# EAGLE schematic Analog CAN Module (EAGLE 8.3.2)
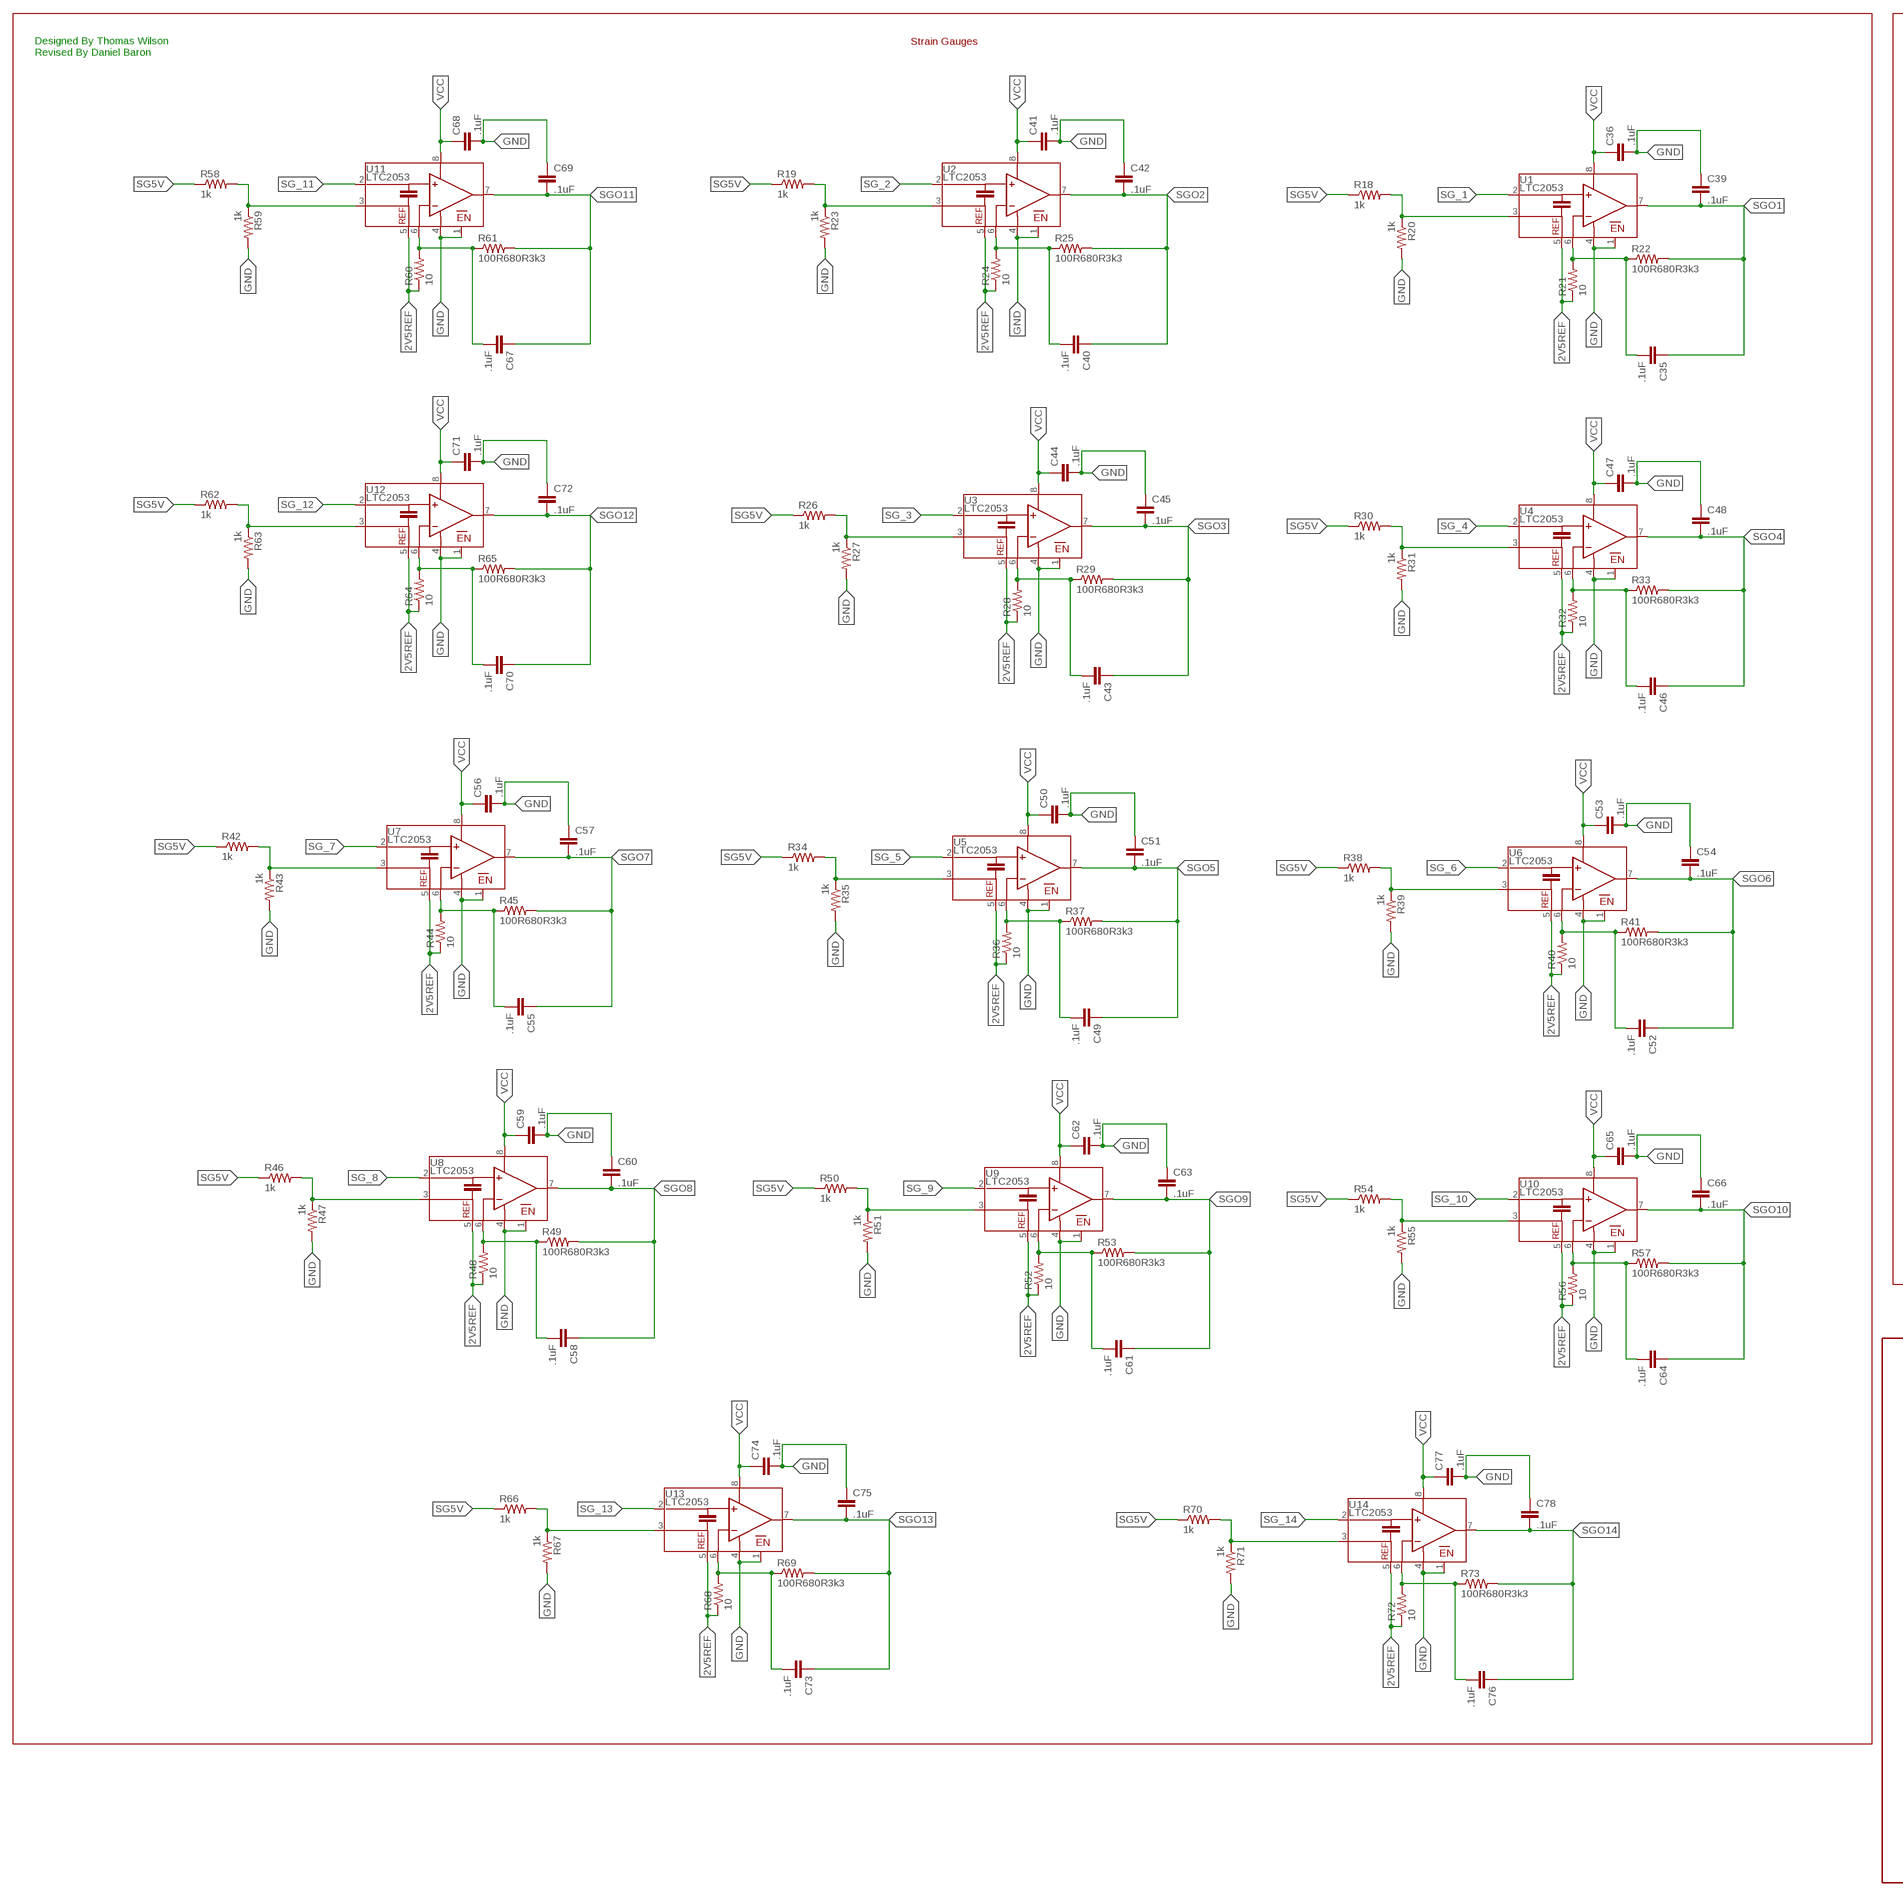
[diagram p0: schematic, sheet 1, part 1 of 3]
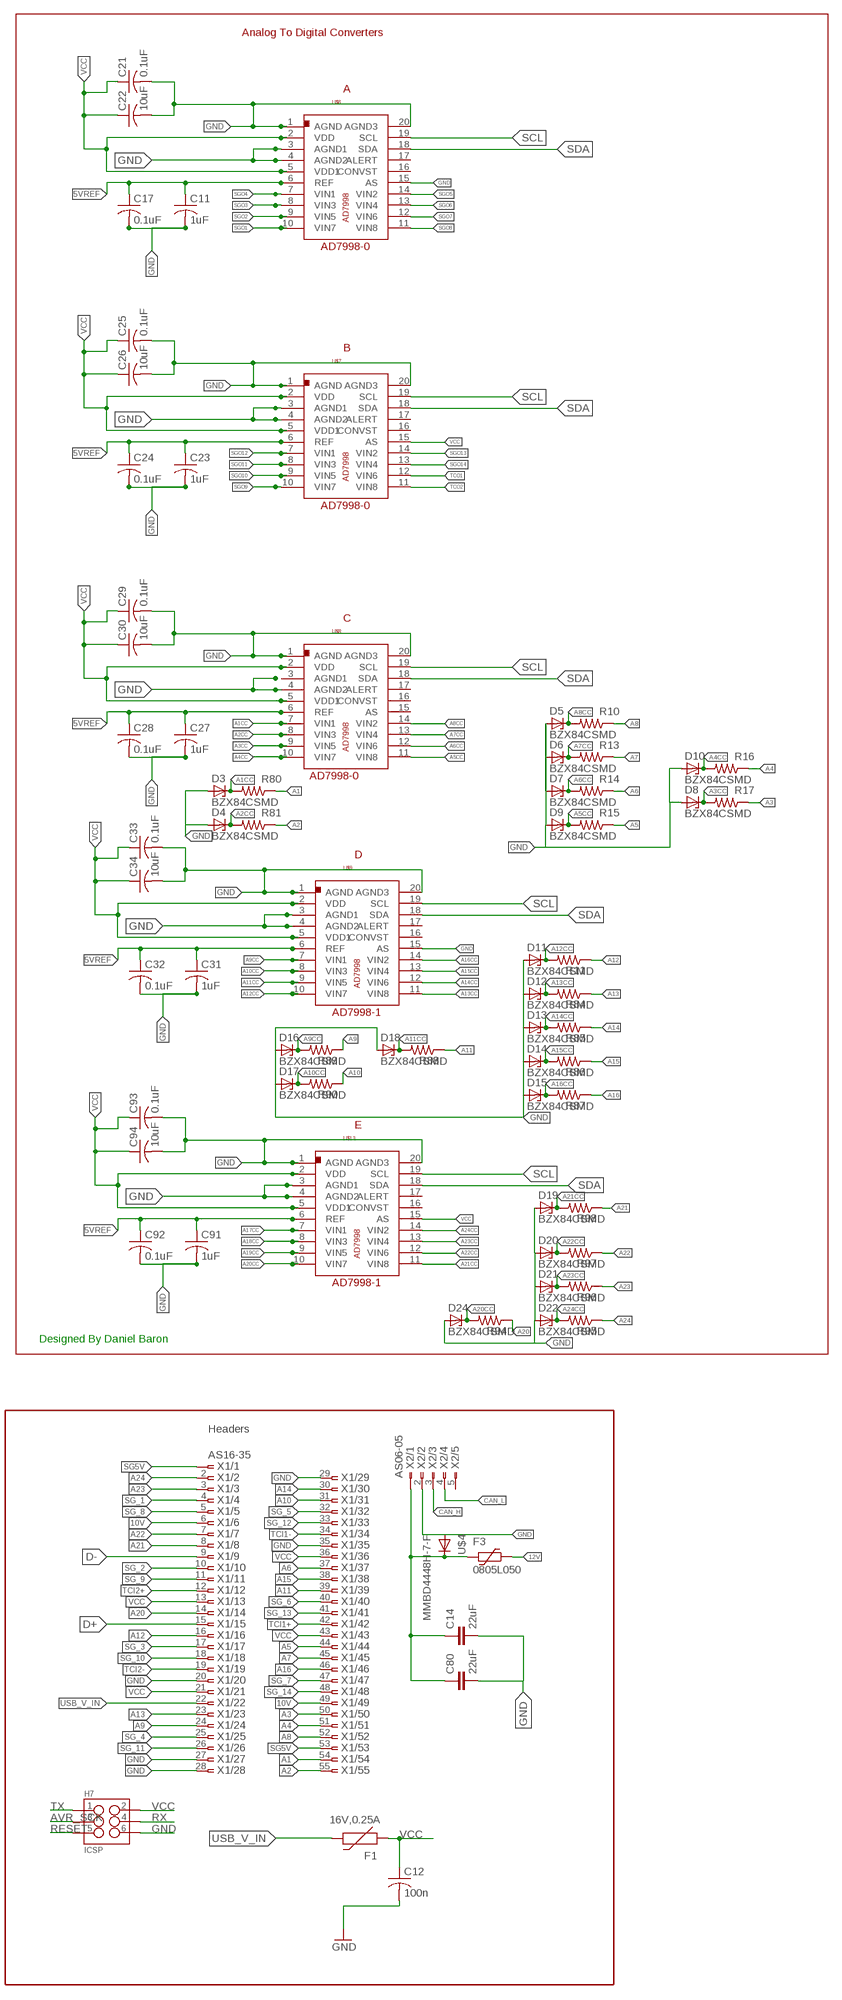
[diagram p1: schematic, sheet 1, part 2 of 3]
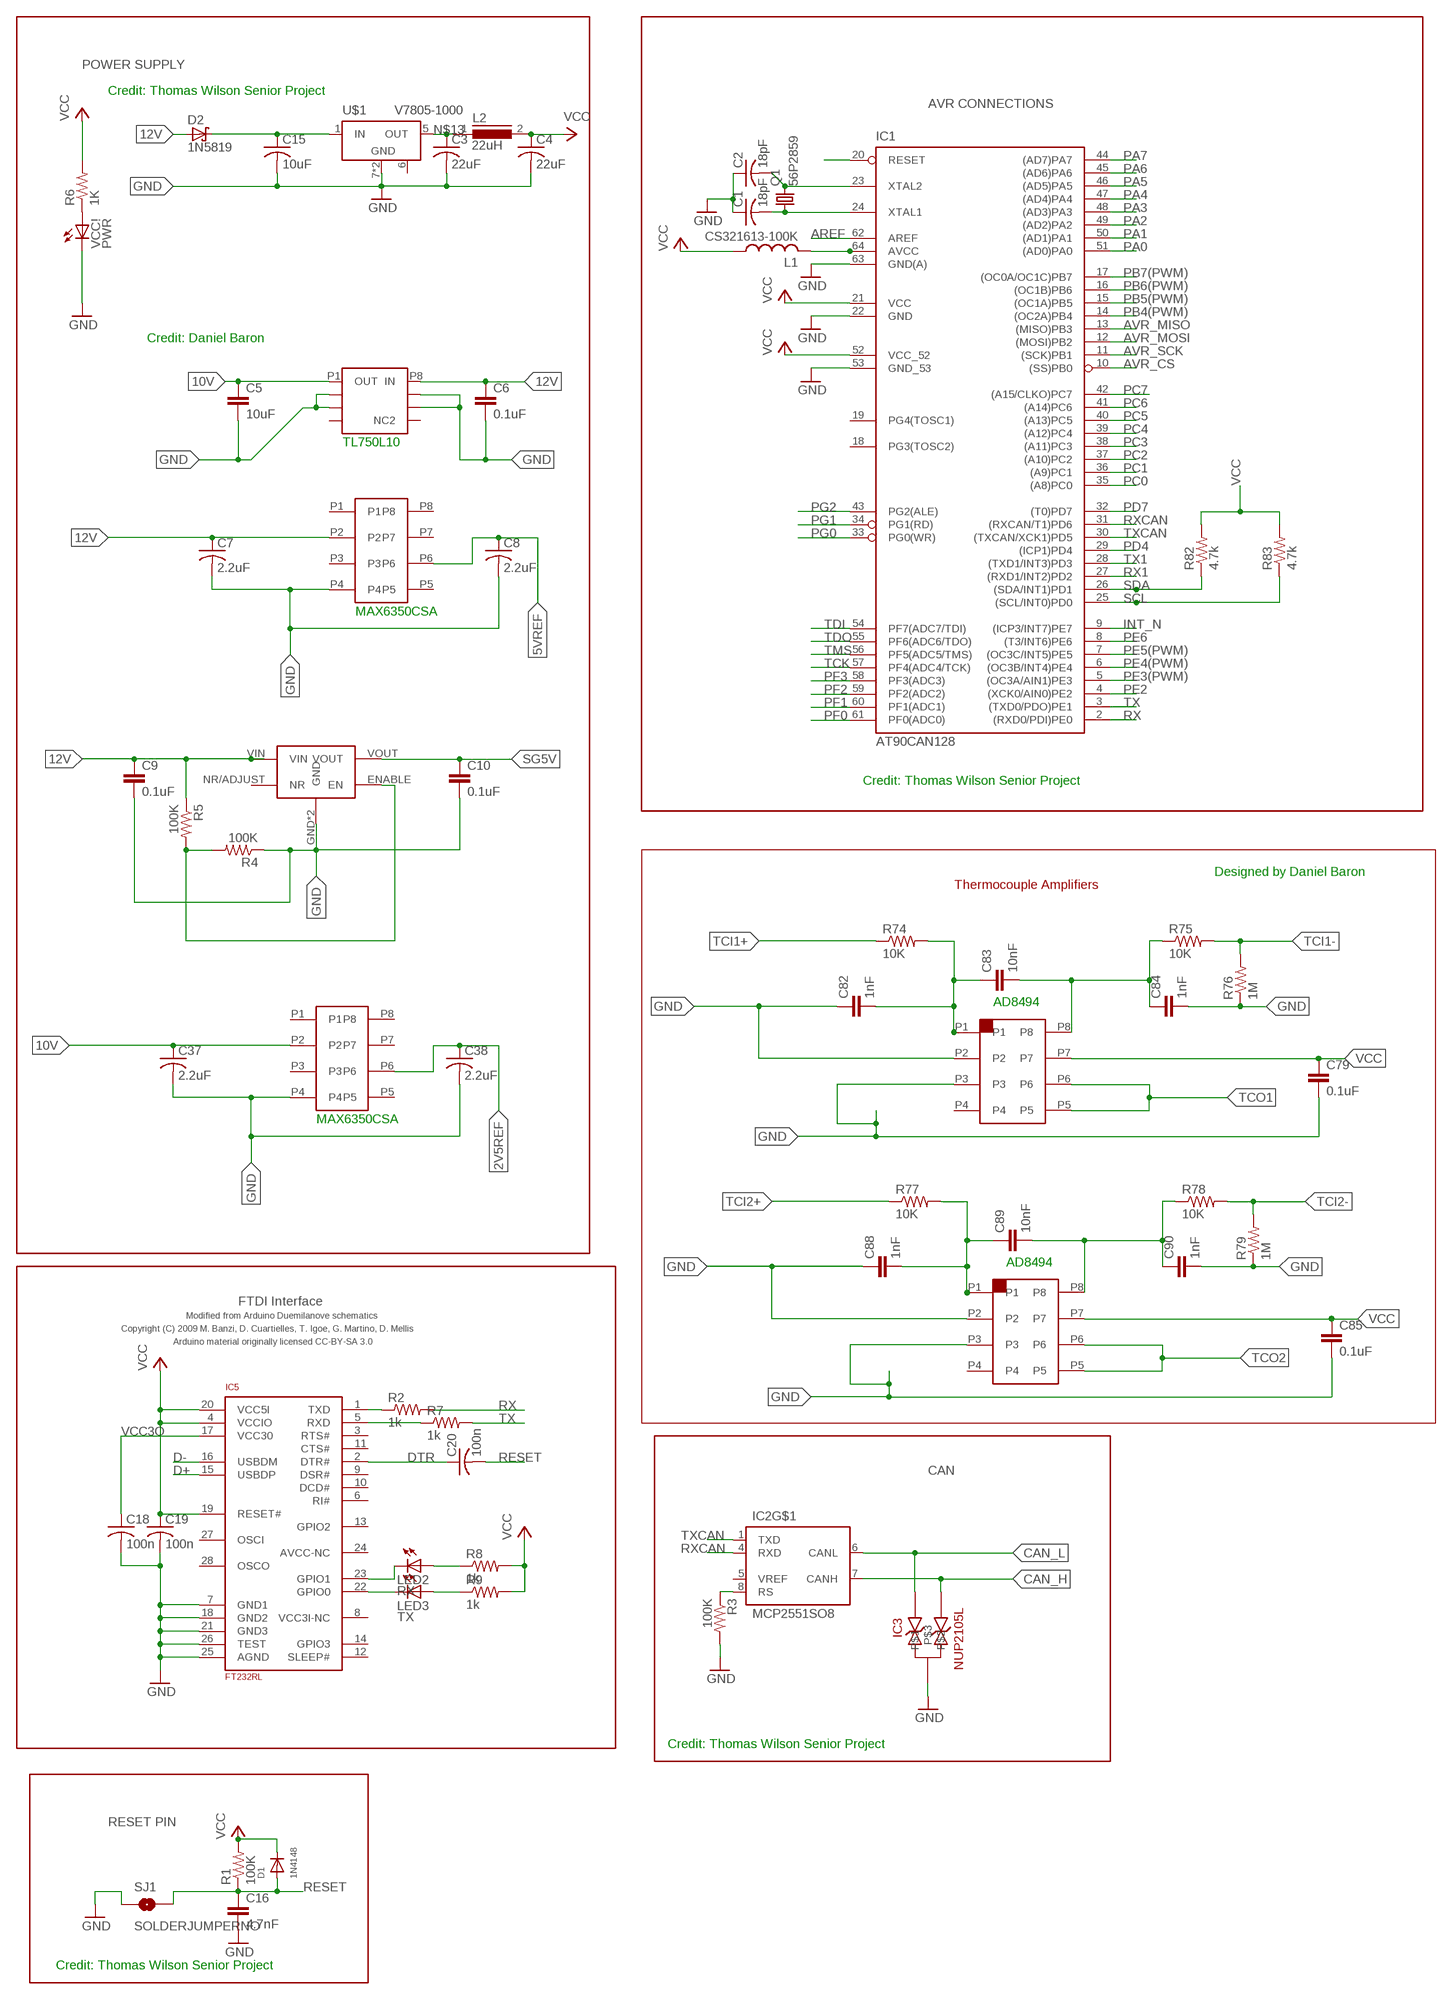
[diagram p2: schematic, sheet 1, part 3 of 3]

## Parts
C1  18pF  C-USC0805  [C0805@1]
C2  18pF  C-USC0805  [C0805@1]
C3  22uF  C-USC0805  [C0805]
C4  22uF  C-USC0805  [C0805]
C5  10uF  C-EUC0805  [C0805]
C6  0.1uF  C-EUC0603  [C0603]
C7  2.2uF  C-USC0603  [C0603@1]
C8  2.2uF  C-USC0603  [C0603@1]
C9  0.1uF  C-EUC0603  [C0603]
C10  0.1uF  C-EUC0603  [C0603]
C11  1uF  C-USC0603  [C0603@1]
C12  100n  C-USC0805  [C0805@1]
C14  22uF  C-EUC0805  [C0805]
C15  10uF  C-USC0805  [C0805]
C16  4.7nF  CAP0603-CAP  [0603-CAP]
C17  0.1uF  C-USC0603  [C0603@1]
C18  100n  C-USC0805  [C0805@1]
C19  100n  C-USC0805  [C0805@1]
C20  100n  C-USC0805  [C0805@1]
C21  0.1uF  C-USC0603  [C0603@1]
C22  10uF  C-USC0805  [C0805@1]
C23  1uF  C-USC0603  [C0603@1]
C24  0.1uF  C-USC0603  [C0603@1]
C25  0.1uF  C-USC0603  [C0603@1]
C26  10uF  C-USC0805  [C0805@1]
C27  1uF  C-USC0603  [C0603@1]
C28  0.1uF  C-USC0603  [C0603@1]
C29  0.1uF  C-USC0603  [C0603@1]
C30  10uF  C-USC0805  [C0805@1]
C31  1uF  C-USC0603  [C0603@1]
C32  0.1uF  C-USC0603  [C0603@1]
C33  0.1uF  C-USC0603  [C0603@1]
C34  10uF  C-USC0805  [C0805@1]
C35  .1uF  CAP0603-CAP  [0603-CAP]
C36  .1uF  CAP0603-CAP  [0603-CAP]
C37  2.2uF  C-USC0603  [C0603@1]
C38  2.2uF  C-USC0603  [C0603@1]
C39  .1uF  CAP0603-CAP  [0603-CAP]
C40  .1uF  CAP0603-CAP  [0603-CAP]
C41  .1uF  CAP0603-CAP  [0603-CAP]
C42  .1uF  CAP0603-CAP  [0603-CAP]
C43  .1uF  CAP0603-CAP  [0603-CAP]
C44  .1uF  CAP0603-CAP  [0603-CAP]
C45  .1uF  CAP0603-CAP  [0603-CAP]
C46  .1uF  CAP0603-CAP  [0603-CAP]
C47  .1uF  CAP0603-CAP  [0603-CAP]
C48  .1uF  CAP0603-CAP  [0603-CAP]
C49  .1uF  CAP0603-CAP  [0603-CAP]
C50  .1uF  CAP0603-CAP  [0603-CAP]
C51  .1uF  CAP0603-CAP  [0603-CAP]
C52  .1uF  CAP0603-CAP  [0603-CAP]
C53  .1uF  CAP0603-CAP  [0603-CAP]
C54  .1uF  CAP0603-CAP  [0603-CAP]
C55  .1uF  CAP0603-CAP  [0603-CAP]
C56  .1uF  CAP0603-CAP  [0603-CAP]
C57  .1uF  CAP0603-CAP  [0603-CAP]
C58  .1uF  CAP0603-CAP  [0603-CAP]
C59  .1uF  CAP0603-CAP  [0603-CAP]
C60  .1uF  CAP0603-CAP  [0603-CAP]
C61  .1uF  CAP0603-CAP  [0603-CAP]
C62  .1uF  CAP0603-CAP  [0603-CAP]
C63  .1uF  CAP0603-CAP  [0603-CAP]
C64  .1uF  CAP0603-CAP  [0603-CAP]
C65  .1uF  CAP0603-CAP  [0603-CAP]
C66  .1uF  CAP0603-CAP  [0603-CAP]
C67  .1uF  CAP0603-CAP  [0603-CAP]
C68  .1uF  CAP0603-CAP  [0603-CAP]
C69  .1uF  CAP0603-CAP  [0603-CAP]
C70  .1uF  CAP0603-CAP  [0603-CAP]
C71  .1uF  CAP0603-CAP  [0603-CAP]
C72  .1uF  CAP0603-CAP  [0603-CAP]
C73  .1uF  CAP0603-CAP  [0603-CAP]
C74  .1uF  CAP0603-CAP  [0603-CAP]
C75  .1uF  CAP0603-CAP  [0603-CAP]
C76  .1uF  CAP0603-CAP  [0603-CAP]
C77  .1uF  CAP0603-CAP  [0603-CAP]
C78  .1uF  CAP0603-CAP  [0603-CAP]
C79  0.1uF  C-EUC0603  [C0603]
C80  22uF  C-EUC0805  [C0805]
C82  1nF  C-EUC0603  [C0603]
C83  10nF  C-EUC0603  [C0603]
C84  1nF  C-EUC0603  [C0603]
C85  0.1uF  C-EUC0603  [C0603]
C88  1nF  C-EUC0603  [C0603]
C89  10nF  C-EUC0603  [C0603]
C90  1nF  C-EUC0603  [C0603]
C91  1uF  C-USC0603  [C0603@1]
C92  0.1uF  C-USC0603  [C0603@1]
C93  0.1uF  C-USC0603  [C0603@1]
C94  10uF  C-USC0805  [C0805@1]
D1  1N4148  DIODESOD-123  [SOD-123]
D2  1N5819  1N5819-B  [DO41-7.6]
D3  BZX84CSMD  [TO236]
D4  BZX84CSMD  [TO236]
D5  BZX84CSMD  [TO236]
D6  BZX84CSMD  [TO236]
D7  BZX84CSMD  [TO236]
D8  BZX84CSMD  [TO236]
D9  BZX84CSMD  [TO236]
D10  BZX84CSMD  [TO236]
D11  BZX84CSMD  [TO236]
D12  BZX84CSMD  [TO236]
D13  BZX84CSMD  [TO236]
D14  BZX84CSMD  [TO236]
D15  BZX84CSMD  [TO236]
D16  BZX84CSMD  [TO236]
D17  BZX84CSMD  [TO236]
D18  BZX84CSMD  [TO236]
D19  BZX84CSMD  [TO236]
D20  BZX84CSMD  [TO236]
D21  BZX84CSMD  [TO236]
D22  BZX84CSMD  [TO236]
D24  BZX84CSMD  [TO236]
F1  16V,0.25A  PTCSMD  [PTC-1206]
F3  0805L050  [0805L]
H7  ICSP  M03X2SMD_FCI  [2X3_SMD_FCI_54202-G30]
IC1  AT90CAN128  [TQFP64]
IC2  MCP2551SO8  [SO08]
IC3  NUP2105L  [SOT-23]
IC5  FT232RL  [SSOP28]
L1  CS321613-100K  L-USL3216C  [L3216C]
L2  22uH  DR73  [DR73]
LED2  RX  LEDCHIPLED_0805  [CHIPLED_0805]
LED3  TX  LEDCHIPLED_0805  [CHIPLED_0805]
Q1  56P2859  CRYSTALSMD  [HC49UP]
R1  100K  R-US_R0805  [R0805]
R2  1k  R-US_R0805  [R0805]
R3  100K  R-US_R0805  [R0805]
R4  100K  R-US_M0805  [M0805]
R5  100K  R-US_M0805  [M0805]
R6  1K  R-US_R0805  [R0805]
R7  1k  R-US_R0805  [R0805]
R8  1k  R-US_R0805  [R0805]
R9  1k  R-US_R0805  [R0805]
R10  180  R-US_R0603  [R0603]
R11  R-US_R0603  [R0603]
R13  180  R-US_R0603  [R0603]
R14  180  R-US_R0603  [R0603]
R15  180  R-US_R0603  [R0603]
R16  180  R-US_R0603  [R0603]
R17  180  R-US_R0603  [R0603]
R18  1k  RESISTOR0603  [0603-RES]
R19  1k  RESISTOR0603  [0603-RES]
R20  1k  RESISTOR0603  [0603-RES]
R21  10  RESISTOR0603  [0603-RES]
R22  100R680R3k3  RESISTOR0603  [0603-RES]
R23  1k  RESISTOR0603  [0603-RES]
R24  10  RESISTOR0603  [0603-RES]
R25  100R680R3k3  RESISTOR0603  [0603-RES]
R26  1k  RESISTOR0603  [0603-RES]
R27  1k  RESISTOR0603  [0603-RES]
R28  10  RESISTOR0603  [0603-RES]
R29  100R680R3k3  RESISTOR0603  [0603-RES]
R30  1k  RESISTOR0603  [0603-RES]
R31  1k  RESISTOR0603  [0603-RES]
R32  10  RESISTOR0603  [0603-RES]
R33  100R680R3k3  RESISTOR0603  [0603-RES]
R34  1k  RESISTOR0603  [0603-RES]
R35  1k  RESISTOR0603  [0603-RES]
R36  10  RESISTOR0603  [0603-RES]
R37  100R680R3k3  RESISTOR0603  [0603-RES]
R38  1k  RESISTOR0603  [0603-RES]
R39  1k  RESISTOR0603  [0603-RES]
R40  10  RESISTOR0603  [0603-RES]
R41  100R680R3k3  RESISTOR0603  [0603-RES]
R42  1k  RESISTOR0603  [0603-RES]
R43  1k  RESISTOR0603  [0603-RES]
R44  10  RESISTOR0603  [0603-RES]
R45  100R680R3k3  RESISTOR0603  [0603-RES]
R46  1k  RESISTOR0603  [0603-RES]
R47  1k  RESISTOR0603  [0603-RES]
R48  10  RESISTOR0603  [0603-RES]
R49  100R680R3k3  RESISTOR0603  [0603-RES]
R50  1k  RESISTOR0603  [0603-RES]
R51  1k  RESISTOR0603  [0603-RES]
R52  10  RESISTOR0603  [0603-RES]
R53  100R680R3k3  RESISTOR0603  [0603-RES]
R54  1k  RESISTOR0603  [0603-RES]
R55  1k  RESISTOR0603  [0603-RES]
R56  10  RESISTOR0603  [0603-RES]
R57  100R680R3k3  RESISTOR0603  [0603-RES]
R58  1k  RESISTOR0603  [0603-RES]
R59  1k  RESISTOR0603  [0603-RES]
R60  10  RESISTOR0603  [0603-RES]
R61  100R680R3k3  RESISTOR0603  [0603-RES]
R62  1k  RESISTOR0603  [0603-RES]
R63  1k  RESISTOR0603  [0603-RES]
R64  10  RESISTOR0603  [0603-RES]
R65  100R680R3k3  RESISTOR0603  [0603-RES]
R66  1k  RESISTOR0603  [0603-RES]
R67  1k  RESISTOR0603  [0603-RES]
R68  10  RESISTOR0603  [0603-RES]
R69  100R680R3k3  RESISTOR0603  [0603-RES]
R70  1k  RESISTOR0603  [0603-RES]
R71  1k  RESISTOR0603  [0603-RES]
R72  10  RESISTOR0603  [0603-RES]
R73  100R680R3k3  RESISTOR0603  [0603-RES]
R74  10K  RESISTOR0603  [0603-RES]
R75  10K  RESISTOR0603  [0603-RES]
R76  1M  RESISTOR0603  [0603-RES]
R77  10K  RESISTOR0603  [0603-RES]
R78  10K  RESISTOR0603  [0603-RES]
R79  1M  RESISTOR0603  [0603-RES]
R80  180  R-US_R0603  [R0603]
R81  180  R-US_R0603  [R0603]
R82  4.7k  R-US_R0805  [R0805]
R83  4.7k  R-US_R0805  [R0805]
R84  R-US_R0603  [R0603]
R85  R-US_R0603  [R0603]
R86  R-US_R0603  [R0603]
R87  R-US_R0603  [R0603]
R88  R-US_R0603  [R0603]
R89  R-US_R0603  [R0603]
R90  R-US_R0603  [R0603]
R94  R-US_R0603  [R0603]
R95  R-US_R0603  [R0603]
R96  R-US_R0603  [R0603]
R97  R-US_R0603  [R0603]
R98  R-US_R0603  [R0603]
SJ1  SOLDERJUMPERNO  [SJ_2S-NO]
U1  LTC2053  [MSOP8]
U2  LTC2053  [MSOP8]
U3  LTC2053  [MSOP8]
U4  LTC2053  [MSOP8]
U5  LTC2053  [MSOP8]
U6  LTC2053  [MSOP8]
U7  LTC2053  [MSOP8]
U8  LTC2053  [MSOP8]
U9  LTC2053  [MSOP8]
U10  LTC2053  [MSOP8]
U11  LTC2053  [MSOP8]
U12  LTC2053  [MSOP8]
U13  LTC2053  [MSOP8]
U14  LTC2053  [MSOP8]
U$1  V7805-1000  V78XX-1000  [V78XX-1000]
U$2  TL750L10  [8-SOIC]
U$4  MMBD4448H-7-F  [SOT23-3]
U$4V5V  MAX6350CSA  [8-SOIC]
U$5  REG-104GA-5  [REG104GA-5]
U$6  AD7998  [20TSSOP]
U$7  AD7998  [20TSSOP]
U$8  AD7998  [20TSSOP]
U$9  AD7998  [20TSSOP]
U$10V2V5  MAX6350CSA  [8-SOIC]
U$11  AD8495  [8MSOP]
U$12  AD8495  [8MSOP]
U$13  AD7998  [20TSSOP]
VCC!  PWR  LEDCHIPLED_0805  [CHIPLED_0805]
X1  AS16-35  [AS16-35]
X2  AS06-05  [AS06-05]

## Nets
2V5REF: C38.1 R21.1 R24.1 R28.1 R32.1 R36.1 R40.1 R44.1 R48.1 R52.1 R56.1 R60.1 R64.1 R68.1 R72.1 U1.5(REF) U2.5(REF) U3.5(REF) U4.5(REF) U5.5(REF) U6.5(REF) U7.5(REF) U8.5(REF) U9.5(REF) U10.5(REF) U11.5(REF) U12.5(REF) U13.5(REF) U14.5(REF) U$10V2V5.P6
5VREF: C8.1 C11.1 C17.1 C23.1 C24.1 C27.1 C28.1 C31.1 C32.1 C91.1 C92.1 U$4V5V.P6 U$6.6(REF) U$7.6(REF) U$8.6(REF) U$9.6(REF) U$13.6(REF)
10V: C5.1 C37.1 U$2.P1(OUT) U$10V2V5.P2 X1.6 X1.49
12V: C6.1 C7.1 C9.1 D2.A F3.1 R5.1 U$2.P8(IN) U$4V5V.P2 U$5.VIN
12V_PREPTC: C14.1 C80.1 F3.2 U$4.3(C) X2.1
12V_PROTECTED: C15.1 D2.C U$1.1(IN)
A1: R80.1 X1.54
A1CC: D3.C R80.2 U$8.7(VIN1)
A2: R81.1 X1.55
A2CC: D4.C R81.2 U$8.8(VIN3)
A3: R17.1 X1.50
A3CC: D8.C R17.2 U$8.9(VIN5)
A4: R16.1 X1.51
A4CC: D10.C R16.2 U$8.10(VIN7)
A5: R15.1 X1.44
A5CC: D9.C R15.2 U$8.11(VIN8)
A6: R14.1 X1.37
A6CC: D7.C R14.2 U$8.12(VIN6)
A7: R13.1 X1.45
A7CC: D6.C R13.2 U$8.13(VIN4)
A8: R10.1 X1.52
A8CC: D5.C R10.2 U$8.14(VIN2)
A9: R89.1 X1.24
A9CC: D16.C R89.2 U$9.7(VIN1)
A10: R90.1 X1.31
A10CC: D17.C R90.2 U$9.8(VIN3)
A11: R88.1 X1.39
A11CC: D18.C R88.2 U$9.9(VIN5)
A12: R11.1 X1.16
A12CC: D11.C R11.2 U$9.10(VIN7)
A13: R84.1 X1.23
A13CC: D12.C R84.2 U$9.11(VIN8)
A14: R85.1 X1.30
A14CC: D13.C R85.2 U$9.12(VIN6)
A15: R86.1 X1.38
A15CC: D14.C R86.2 U$9.13(VIN4)
A16: R87.1 X1.46
A16CC: D15.C R87.2 U$9.14(VIN2)
A17CC: U$13.7(VIN1)
A18CC: U$13.8(VIN3)
A19CC: U$13.9(VIN5)
A20: R94.1 X1.14
A20CC: D24.C R94.2 U$13.10(VIN7)
A21: R98.1 X1.8
A21CC: D19.C R98.2 U$13.11(VIN8)
A22: R97.1 X1.7
A22CC: D20.C R97.2 U$13.12(VIN6)
A23: R96.1 X1.3
A23CC: D21.C R96.2 U$13.13(VIN4)
A24: R95.1 X1.2
A24CC: D22.C R95.2 U$13.14(VIN2)
AREF: IC1.62(AREF)
AVR_CS: IC1.10((SS)PB0)
AVR_MISO: IC1.13((MISO)PB3)
AVR_MOSI: IC1.12((MOSI)PB2)
AVR_SCK: H7.3 IC1.11((SCK)PB1)
CAN_H: IC2.7(CANH) IC3.2 X2.3
CAN_L: IC2.6(CANL) IC3.1 X2.4
D+: IC5.15(USBDP) X1.15
D-: IC5.16(USBDM) X1.9
DTR: C20.1 IC5.2(DTR#)
GND: C1.1 C2.1 C3.2 C4.2 C5.2 C6.2 C7.2 C8.2 C9.2 C10.2 C11.2 C12.2 C14.2 C15.2 C16.2 C17.2 C18.2 C19.2 C21.2 C22.2 C23.2 C24.2 C25.2 C26.2 C27.2 C28.2 C29.2 C30.2 C31.2 C32.2 C33.2 C34.2 C36.2 C37.2 C38.2 C39.1 C41.2 C42.1 C44.2 C45.1 C47.2 C48.1 C50.2 C51.1 C53.2 C54.1 C56.2 C57.1 C59.2 C60.1 C62.2 C63.1 C65.2 C66.1 C68.2 C69.1 C71.2 C72.1 C74.2 C75.1 C77.2 C78.1 C79.2 C80.2 C82.1 C84.2 C85.2 C88.1 C90.2 C91.2 C92.2 C93.2 C94.2 D3.A D4.A D5.A D6.A D7.A D8.A D9.A D10.A D11.A D12.A D13.A D14.A D15.A D16.A D17.A D18.A D19.A D20.A D21.A D22.A D24.A H7.6 IC1.22(GND) IC1.53(GND_53) IC1.63(GND(A)) IC3.3 IC5.7(GND1) IC5.18(GND2) IC5.21(GND3) IC5.25(AGND) IC5.26(TEST) R3.2 R4.1 R20.2 R23.2 R27.2 R31.2 R35.2 R39.2 R43.2 R47.2 R51.2 R55.2 R59.2 R63.2 R67.2 R71.2 R76.1 R79.1 SJ1.1 U1.1(EN) U1.4(V-) U2.1(EN) U2.4(V-) U3.1(EN) U3.4(V-) U4.1(EN) U4.4(V-) U5.1(EN) U5.4(V-) U6.1(EN) U6.4(V-) U7.1(EN) U7.4(V-) U8.1(EN) U8.4(V-) U9.1(EN) U9.4(V-) U10.1(EN) U10.4(V-) U11.1(EN) U11.4(V-) U12.1(EN) U12.4(V-) U13.1(EN) U13.4(V-) U14.1(EN) U14.4(V-) U$1.7(GND) U$1.9(GND) U$2.P2(COM) U$2.P3(COM2) U$2.P6(COM3) U$2.P7(COM4) U$4.1(A) U$4V5V.P4 U$5.GND U$5.HEATGND(GND) U$6.1(AGND) U$6.3(AGND1) U$6.4(AGND2) U$6.15(AS) U$6.20(AGND3) U$7.1(AGND) U$7.3(AGND1) U$7.4(AGND2) U$7.20(AGND3) U$8.1(AGND) U$8.4(AGND2) U$8.20(AGND3) U$9.1(AGND) U$9.3(AGND1) U$9.4(AGND2) U$9.15(AS) U$9.20(AGND3) U$10V2V5.P4 U$11.P2 U$11.P3 U$12.P2 U$12.P3 U$13.1(AGND) U$13.3(AGND1) U$13.4(AGND2) U$13.20(AGND3) VCC!.C X1.20 X1.27 X1.28 X1.29 X1.35 X2.2
INT_N: IC1.9((ICP3/INT7)PE7)
M8RXD: IC5.1(TXD) R2.1
M8TXD: IC5.5(RXD) R7.1
N$1: C35.2 R21.2 R22.1 U1.6(RG)
N$2: R4.2 R5.2 U$5.ENABLE(EN)
N$3: R66.2 R67.1 U13.3(+IN)
N$4: R18.2 R20.1 U1.3(+IN)
N$5: R19.2 R23.1 U2.3(+IN)
N$6: IC2.8(RS) R3.1
N$7: C40.2 R24.2 R25.1 U2.6(RG)
N$8: R26.2 R27.1 U3.3(+IN)
N$9: R6.1 VCC!.A
N$10: C43.2 R28.2 R29.1 U3.6(RG)
N$11: C1.2 IC1.24(XTAL1) Q1.1
N$12: R30.2 R31.1 U4.3(+IN)
N$13: C3.1 L2.1 U$1.5(OUT)
N$14: C46.2 R32.2 R33.1 U4.6(RG)
N$15: R34.2 R35.1 U5.3(+IN)
N$16: C49.2 R36.2 R37.1 U5.6(RG)
N$17: R38.2 R39.1 U6.3(+IN)
N$18: C52.2 R40.2 R41.1 U6.6(RG)
N$19: R42.2 R43.1 U7.3(+IN)
N$20: C55.2 R44.2 R45.1 U7.6(RG)
N$21: R46.2 R47.1 U8.3(+IN)
N$22: IC1.64(AVCC) L1.2
N$23: C58.2 R48.2 R49.1 U8.6(RG)
N$24: R50.2 R51.1 U9.3(+IN)
N$25: C61.2 R52.2 R53.1 U9.6(RG)
N$26: R54.2 R55.1 U10.3(+IN)
N$27: C64.2 R56.2 R57.1 U10.6(RG)
N$28: R58.2 R59.1 U11.3(+IN)
N$29: C67.2 R60.2 R61.1 U11.6(RG)
N$30: R62.2 R63.1 U12.3(+IN)
N$31: C70.2 R64.2 R65.1 U12.6(RG)
N$32: IC5.23(GPIO1) LED2.C
N$33: C73.2 R68.2 R69.1 U13.6(RG)
N$34: IC5.22(GPIO0) LED3.C
N$35: LED2.A R8.1
N$36: LED3.A R9.1
N$37: R70.2 R71.1 U14.3(+IN)
N$38: C76.2 R72.2 R73.1 U14.6(RG)
N$40: C88.2 C89.1 R77.2 U$12.P1
N$41: C83.2 C84.1 R75.1 U$11.P8
N$42: C89.2 C90.1 R78.1 U$12.P8
N$43: C82.2 C83.1 R74.2 U$11.P1
PA0: IC1.51((AD0)PA0)
PA1: IC1.50((AD1)PA1)
PA2: IC1.49((AD2)PA2)
PA3: IC1.48((AD3)PA3)
PA4: IC1.47((AD4)PA4)
PA5: IC1.46((AD5)PA5)
PA6: IC1.45((AD6)PA6)
PA7: IC1.44((AD7)PA7)
PB4(PWM): IC1.14((OC2A)PB4)
PB5(PWM): IC1.15((OC1A)PB5)
PB6(PWM): IC1.16((OC1B)PB6)
PB7(PWM): IC1.17((OC0A/OC1C)PB7)
PC0: IC1.35((A8)PC0)
PC1: IC1.36((A9)PC1)
PC2: IC1.37((A10)PC2)
PC3: IC1.38((A11)PC3)
PC4: IC1.39((A12)PC4)
PC5: IC1.40((A13)PC5)
PC6: IC1.41((A14)PC6)
PC7: IC1.42((A15/CLKO)PC7)
PD4: IC1.29((ICP1)PD4)
PD7: IC1.32((T0)PD7)
PE2: IC1.4((XCK0/AIN0)PE2)
PE3(PWM): IC1.5((OC3A/AIN1)PE3)
PE4(PWM): IC1.6((OC3B/INT4)PE4)
PE5(PWM): IC1.7((OC3C/INT5)PE5)
PE6: IC1.8((T3/INT6)PE6)
PF0: IC1.61(PF0(ADC0))
PF1: IC1.60(PF1(ADC1))
PF2: IC1.59(PF2(ADC2))
PF3: IC1.58(PF3(ADC3))
PG0: IC1.33(PG0(WR))
PG1: IC1.34(PG1(RD))
PG2: IC1.43(PG2(ALE))
RESET: C16.1 C20.2 D1.A H7.5 IC1.20(RESET) R1.1 SJ1.2
RX: H7.4 IC1.2((RXD0/PDI)PE0) R2.2
RX1: IC1.27((RXD1/INT2)PD2)
RXCAN: IC1.31((RXCAN/T1)PD6) IC2.4(RXD)
SCL: IC1.25((SCL/INT0)PD0) R83.1 U$6.19(SCL) U$7.19(SCL) U$8.19(SCL) U$9.19(SCL) U$13.19(SCL)
SDA: IC1.26((SDA/INT1)PD1) R82.1 U$6.18(SDA) U$7.18(SDA) U$8.18(SDA) U$9.18(SDA) U$13.18(SDA)
SG5V: C10.1 R18.1 R19.1 R26.1 R30.1 R34.1 R38.1 R42.1 R46.1 R50.1 R54.1 R58.1 R62.1 R66.1 R70.1 U$5.VOUT X1.1 X1.53
SG_1: U1.2(-IN) X1.4
SG_2: U2.2(-IN) X1.10
SG_3: U3.2(-IN) X1.17
SG_4: U4.2(-IN) X1.25
SG_5: U5.2(-IN) X1.32
SG_6: U6.2(-IN) X1.40
SG_7: U7.2(-IN) X1.47
SG_8: U8.2(-IN) X1.5
SG_9: U9.2(-IN) X1.11
SG_10: U10.2(-IN) X1.18
SG_11: U11.2(-IN) X1.26
SG_12: U12.2(-IN) X1.33
SG_13: U13.2(-IN) X1.41
SG_14: U14.2(-IN) X1.48
SGO1: C35.1 C39.2 R22.2 U1.7(OUT) U$6.10(VIN7)
SGO2: C40.1 C42.2 R25.2 U2.7(OUT) U$6.9(VIN5)
SGO3: C43.1 C45.2 R29.2 U3.7(OUT) U$6.8(VIN3)
SGO4: C46.1 C48.2 R33.2 U4.7(OUT) U$6.7(VIN1)
SGO5: C49.1 C51.2 R37.2 U5.7(OUT) U$6.14(VIN2)
SGO6: C52.1 C54.2 R41.2 U6.7(OUT) U$6.13(VIN4)
SGO7: C55.1 C57.2 R45.2 U7.7(OUT) U$6.12(VIN6)
SGO8: C58.1 C60.2 R49.2 U8.7(OUT) U$6.11(VIN8)
SGO9: C61.1 C63.2 R53.2 U9.7(OUT) U$7.10(VIN7)
SGO10: C64.1 C66.2 R57.2 U10.7(OUT) U$7.9(VIN5)
SGO11: C67.1 C69.2 R61.2 U11.7(OUT) U$7.8(VIN3)
SGO12: C70.1 C72.2 R65.2 U12.7(OUT) U$7.7(VIN1)
SGO13: C73.1 C75.2 R69.2 U13.7(OUT) U$7.14(VIN2)
SGO14: C76.1 C78.2 R73.2 U14.7(OUT) U$7.13(VIN4)
TCI1+: R74.1 X1.42
TCI1-: R75.2 R76.2 X1.34
TCI2+: R77.1 X1.12
TCI2-: R78.2 R79.2 X1.19
TCK: IC1.57(PF4(ADC4/TCK))
TCO1: U$7.12(VIN6) U$11.P5 U$11.P6
TCO2: U$7.11(VIN8) U$12.P5 U$12.P6
TDI: IC1.54(PF7(ADC7/TDI))
TDO: IC1.55(PF6(ADC6/TDO))
TMS: IC1.56(PF5(ADC5/TMS))
TX: H7.1 IC1.3((TXD0/PDO)PE1) R7.2
TX1: IC1.28((TXD1/INT3)PD3)
TXCAN: IC1.30((TXCAN/XCK1)PD5) IC2.1(TXD)
USB_V_IN [usbvcc]: F1.2 X1.22
VCC: C4.1 C12.1 C19.1 C21.1 C22.1 C25.1 C26.1 C29.1 C30.1 C33.1 C34.1 C36.1 C41.1 C44.1 C47.1 C50.1 C53.1 C56.1 C59.1 C62.1 C65.1 C68.1 C71.1 C74.1 C77.1 C79.1 C85.1 C93.1 C94.1 D1.C F1.1 H7.2 IC1.21(VCC) IC1.52(VCC_52) IC5.4(VCCIO) IC5.19(RESET#) IC5.20(VCC5I) L1.1 L2.2 R1.2 R6.2 R8.2 R9.2 R82.2 R83.2 U1.8(V+) U2.8(V+) U3.8(V+) U4.8(V+) U5.8(V+) U6.8(V+) U7.8(V+) U8.8(V+) U9.8(V+) U10.8(V+) U11.8(V+) U12.8(V+) U13.8(V+) U14.8(V+) U$6.2(VDD) U$6.5(VDD1) U$7.2(VDD) U$7.5(VDD1) U$7.15(AS) U$8.2(VDD) U$8.5(VDD1) U$9.2(VDD) U$9.5(VDD1) U$11.P7 U$12.P7 U$13.2(VDD) U$13.5(VDD1) U$13.15(AS) X1.13 X1.21 X1.36 X1.43
VCC3O: C18.1 IC5.17(VCC30)
XTAL1: C2.2 IC1.23(XTAL2) Q1.2
Unconnected: IC1.18(PG3(TOSC2)) IC1.19(PG4(TOSC1)) IC2.5(VREF) IC5.3(RTS#) IC5.6(RI#) IC5.8(VCC3I-NC) IC5.9(DSR#) IC5.10(DCD#) IC5.11(CTS#) IC5.12(SLEEP#) IC5.13(GPIO2) IC5.14(GPIO3) IC5.24(AVCC-NC) IC5.27(OSCI) IC5.28(OSCO) U$1.6 U$2.P4(NC1) U$2.P5(NC2) U$4V5V.P1 U$4V5V.P3 U$4V5V.P5 U$4V5V.P7 U$4V5V.P8 U$5.NR/ADJUST(NR) U$6.16(CONVST) U$6.17(ALERT) U$7.16(CONVST) U$7.17(ALERT) U$8.3(AGND1) U$8.15(AS) U$8.16(CONVST) U$8.17(ALERT) U$9.16(CONVST) U$9.17(ALERT) U$10V2V5.P1 U$10V2V5.P3 U$10V2V5.P5 U$10V2V5.P7 U$10V2V5.P8 U$11.P4 U$12.P4 U$13.16(CONVST) U$13.17(ALERT) X2.5

## Notes on the sheet
- Analog To Digital Converters
- Strain Gauges
- Designed By Thomas Wilson
  Revised By Daniel Baron
- POWER SUPPLY
- A | Credit: Thomas Wilson Senior Project
- AVR CONNECTIONS
- AD7998-0
- Credit: Daniel Baron
- B
- TL750L10
- AD7998-0
- MAX6350CSA
- C
- Credit: Thomas Wilson Senior Project
- Designed by Daniel Baron
- AD7998-0 | Thermocouple Amplifiers
- D
- AD8494
- MAX6350CSA
- AD7998-1
- AD8494
- E
- FTDI Interface
- Modified from Arduino Duemilanove schematics
- Copyright (C) 2009 M. Banzi, D. Cuartielles, T. Igoe, G. Martino, D. Mellis
- Arduino material originally licensed CC-BY-SA 3.0
- AD7998-1 | CAN
- Designed By Daniel Baron
- Headers
- Credit: Thomas Wilson Senior Project
- RESET PIN
- Credit: Thomas Wilson Senior Project

## Power pins joined to a net without a drawn wire
GND: IC2.2(GND)
VCC: IC2.3(VCC)

## Library data of the parts
C1 C2 C7 C8 C11 C12 C17-C34 C37 C38 C91-C94 = rcl:C-US: CAPACITOR, American symbol
C3 C4 C15 = resistor:C-US: CAPACITOR, American symbol
C5 C6 C9 C10 C14 C79 C80 C82-C85 C88-C90 = rcl:C-EU: CAPACITOR, European symbol
C16 = SparkFun-Capacitors:CAP: Capacitor Standard 0603 ceramic capacitor, and 0.1" leaded capacitor.
C35 C36 C39-C78 = SparkFun-Passives:CAP: Capacitor Standard 0603 ceramic capacitor, and 0.1" leaded capacitor.
D1 = adafruit:DIODE: Diode SMADIODE - SMA Surface Mount Package 20V 1A Schottky Diode Digikey: 641-1014-6-ND DO-1N4148 - Through Hole Small Current Diode SOD-123 20V 1 A (.5mV Vf) Schottky Diode - Digikey: MBRX120TPMSCT-ND SOD-323 10V 570mA (.38mV Vf, 3ns) Schottky Diode - Digikey: ZLLS410CT-ND SOD-523 30V 30mA Schottky Diode (RB751S-40TE61) - Digikey: RB751S-40TE61CT-ND SOT23-R/W - SOT23 Package (R = Solder Paste/Reflow Ovens, W = Hand-Soldering) BAT54Film 40V 300mA - Digikey: 497-7162-1-ND
D2 = diode:1N581*: 1.0A SCHOTTKY BARRIER RECTIFIER Source: http://www.diodes.com/datasheets/ds23001.pdf
D3-D22 D24 = diode:BZX84CSMD: Z DIODE
F1 = SparkFun:PTC: Resettable Fuse PTC Resettable Fuse. Spark Fun Electronics SKU : COM-08357
F3 = LittleFuse:?: Polyfuse Resettable PTC Source: http://www.littelfuse.com/products/resettable-ptcs.aspx; MF: Littelfuse; MPN: 0805L050; OC_FARNELL: 1832103; OC_NEWARK: 18M4776
H7 = SparkFun-Connectors:M03X2: 2x3 .1" header. Shrouded, with keying- CONN-10681 SMT- CONN-11415 Pogo pins- HW-11044
IC1 = at90can128:AT90CAN128
IC2 = can:MCP2551: CAN Tranceiver Microchip
IC3 = Artificial Science:NUP2105L
IC5 = SmartPrj:FT232RL
L1 = rcl:L-US: INDUCTOR, American symbol
L2 = inductors:DR73: High Power Density, High Efficiency, Shielded Inductors Source: coiltronics_dr_series.pdf
LED2 LED3 VCC! = led:LED: LED OSRAM: - CHIPLED LG R971, LG N971, LY N971, LG Q971, LY Q971, LO R971, LY R971 LH N974, LH R974 LS Q976, LO Q976, LY Q976 LO Q996 - Hyper CHIPLED LW Q18S LB Q993, LB Q99A, LB R99A - SideLED LS A670, LO A670, LY A670, LG A670, LP A670 LB A673, LV A673, LT A673, LW A673 LH A674 LY A675 LS A676, LA A676, LO A676, LY A676, LW A676 LS A679, LY A679, LG A679 - Hyper Micro SIDELED® LS Y876, LA Y876, LO Y876, LY Y876 LT Y87S - SmartLED LW L88C, LW L88S LB L89C, LB L89S, LG L890 LS L89K, LO L89K, LY L89K LS L896, LA L896, LO L896, LY L896 - TOPLED LS T670, LO T670, LY T670, LG T670, LP T670 LSG T670, LSP T670, LSY T670, LOP T670, LYG T670 LG T671, LOG T671, LSG T671 LB T673, LV T673, LT T673, LW T673 LH T674 LS T676, LA T676, LO T676, LY T676, LB T676, LH T676, LSB T676, LW T676 LB T67C, LV T67C, LT T67C, LS T67K, LO T67K, LY T67K, LW E67C LS E67B, LA E67B, LO E67B, LY E67B, LB E67C, LV E67C, LT E67C LW T67C LS T679, LY T679, LG T679 LS T770, LO T770, LY T770, LG T770, LP T770 LB T773, LV T773, LT T773, LW T773 LH T774 LS E675, LA E675, LY E675, LS T675 LS T776, LA T776, LO T776, LY T776, LB T776 LHGB T686 LT T68C, LB T68C - Hyper Mini TOPLED® LB M676 - Mini TOPLED Santana® LG M470 LS M47K, LO M47K, LY M47K Source: http://www.osram.convergy.de LUXEON: - LUMILED® LXK2-PW12-R00, LXK2-PW12-S00, LXK2-PW14-U00, LXK2-PW14-V00 LXK2-PM12-R00, LXK2-PM12-S00, LXK2-PM14-U00 LXK2-PE12-Q00, LXK2-PE12-R00, LXK2-PE12-S00, LXK2-PE14-T00, LXK2-PE14-U00 LXK2-PB12-K00, LXK2-PB12-L00, LXK2-PB12-M00, LXK2-PB14-N00, LXK2-PB14-P00, LXK2-PB14-Q00 LXK2-PR12-L00, LXK2-PR12-M00, LXK2-PR14-Q00, LXK2-PR14-R00 LXK2-PD12-Q00, LXK2-PD12-R00, LXK2-PD12-S00 LXK2-PH12-R00, LXK2-PH12-S00 LXK2-PL12-P00, LXK2-PL12-Q00, LXK2-PL12-R00 Source: www.luxeon.com KINGBRIGHT: KA-3528ASYC Source: www.kingbright.com
Q1 = SparkFun-FreqCtrl:CRYSTAL: Various standard crystals. Proven footprints. Spark Fun Electronics SKU : COM-00534
R1-R11 R13-R17 R80-R90 R94-R98 = rcl:R-US_: RESISTOR, American symbol
R18-R79 = SparkFun-Resistors:RESISTOR: Resistor Basic schematic elements and footprints for 0603, 1206, and PTH resistors.
SJ1 = SparkFun-Passives:SOLDERJUMPER: Solder Jumper Standard SMD solder jumper. Used to automate production. Two varients : Normally Open and Normally Closed are the same, but have different paste layers. NC will have a large amount of paste and should jumper during reflow.
U1-U14 = linear-technology:LTC2053: DK: LTC2053CMS8#PBF-ND
U$1 = formula electric:V78XX-1000
U$2 = DashAndCAN library:TL750L10
U$4 = diodes-inc:MMBD4448H-7-F
U$4V5V U$10V2V5 = DashAndCAN library:MAX6350CSA
U$5 = DashAndCAN library:REG-104GA-5
U$6-U$9 U$13 = DashAndCAN library:AD7998
U$11 U$12 = DashAndCAN library:AD8495
X1 = con-deutsch:AS16-35: DEUTSCH Connector; OC_FARNELL: unknown; OC_NEWARK: unknown
X2 = con-deutsch:AS06-05: DEUTSCH Connector; OC_FARNELL: unknown; OC_NEWARK: unknown